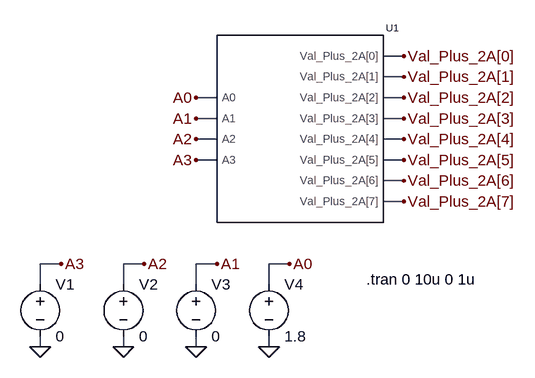
[diagram p0: schematic Val_Plus_2A_Test.asc]
Val_Plus_2A_Test.asc, the LTspice schematic file:
Version 4
SHEET 1 880 680
WIRE 320 48 288 48
WIRE 320 80 288 80
WIRE 32 112 0 112
WIRE 320 112 288 112
WIRE 32 144 0 144
WIRE 320 144 288 144
WIRE 32 176 0 176
WIRE 320 176 288 176
WIRE 32 208 0 208
WIRE 320 208 288 208
WIRE 320 240 288 240
WIRE 320 272 288 272
WIRE -208 368 -240 368
WIRE -80 368 -112 368
WIRE 32 368 0 368
WIRE 144 368 112 368
WIRE -240 400 -240 368
WIRE -112 400 -112 368
WIRE 0 400 0 368
WIRE 112 400 112 368
WIRE -240 496 -240 480
WIRE -112 496 -112 480
WIRE 0 496 0 480
WIRE 112 496 112 480
FLAG 0 112 A0
FLAG 0 144 A1
FLAG 0 176 A2
FLAG 0 208 A3
FLAG 320 48 Val_Plus_2A[0]
FLAG 320 80 Val_Plus_2A[1]
FLAG 320 112 Val_Plus_2A[2]
FLAG 320 144 Val_Plus_2A[3]
FLAG 320 176 Val_Plus_2A[4]
FLAG 320 208 Val_Plus_2A[5]
FLAG 320 240 Val_Plus_2A[6]
FLAG 320 272 Val_Plus_2A[7]
FLAG -240 496 0
FLAG 144 368 A0
FLAG 32 368 A1
FLAG -80 368 A2
FLAG -208 368 A3
FLAG -112 496 0
FLAG 0 496 0
FLAG 112 496 0
SYMBOL Val_Plus_2A 112 160 R0
SYMATTR InstName U1
SYMBOL voltage -240 384 R0
WINDOW 123 0 0 Left 0
WINDOW 39 0 0 Left 0
SYMATTR InstName V1
SYMATTR Value 0
SYMBOL voltage -112 384 R0
WINDOW 123 0 0 Left 0
WINDOW 39 0 0 Left 0
SYMATTR InstName V2
SYMATTR Value 0
SYMBOL voltage 0 384 R0
WINDOW 123 0 0 Left 0
WINDOW 39 0 0 Left 0
SYMATTR InstName V3
SYMATTR Value 0
SYMBOL voltage 112 384 R0
WINDOW 123 0 0 Left 0
WINDOW 39 0 0 Left 0
SYMATTR InstName V4
SYMATTR Value 1.8
TEXT 262 392 Left 2 !.tran 0 10u 0 1u

The netlist it stands for:
* Val_Plus_2A_Test.asc
XU1 A0 A1 A2 A3 Val_Plus_2A[0] Val_Plus_2A[1] Val_Plus_2A[2] Val_Plus_2A[3] Val_Plus_2A[4] Val_Plus_2A[5] Val_Plus_2A[6] Val_Plus_2A[7] Val_Plus_2A  ; pins A0 A1 A2 A3 Val_Plus_2A[0] Val_Plus_2A[1] Val_Plus_2A[2] Val_Plus_2A[3] Val_Plus_2A[4] Val_Plus_2A[5] Val_Plus_2A[6] Val_Plus_2A[7]
V1 A3 0 0
V2 A2 0 0
V3 A1 0 0
V4 A0 0 1.8
.tran 0 10u 0 1u
.lib Val_Plus_2A.sub
.backanno
.end